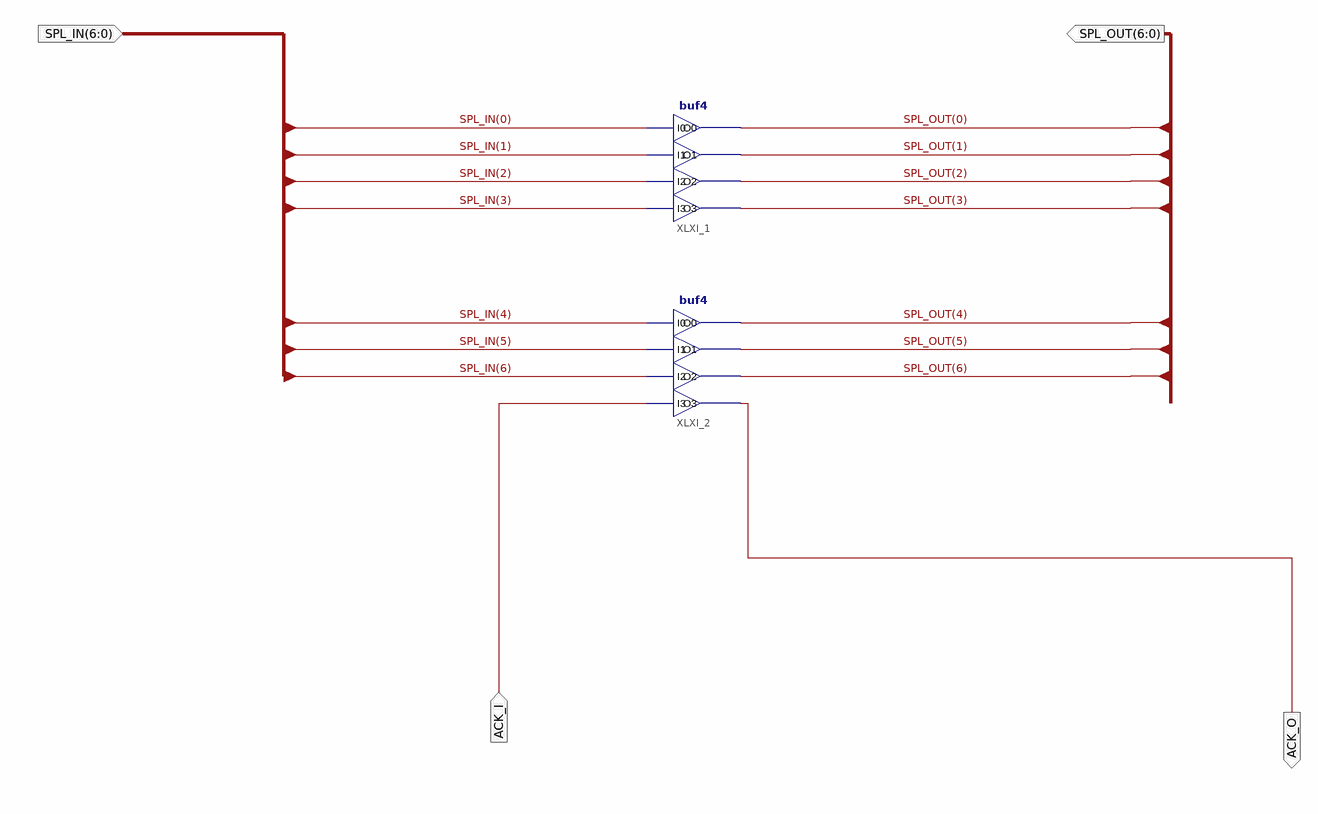
[diagram p0: schematic sheet 1]
// Xilinx ISE schematic spin_router.sch (xbr) as structural Verilog: 2 symbols, 4 ports
module spin_router (
  input  [6:0] SPL_IN,
  input  ACK_I,
  output [6:0] SPL_OUT,
  output ACK_O
);

  buf4 XLXI_1 (
    .I0(SPL_IN[0]), .I1(SPL_IN[1]), .I2(SPL_IN[2]), .I3(SPL_IN[3]), .O0(SPL_OUT[0]), .O1(SPL_OUT[1]),
    .O2(SPL_OUT[2]), .O3(SPL_OUT[3]));
  buf4 XLXI_2 (
    .I0(SPL_IN[4]), .I1(SPL_IN[5]), .I2(SPL_IN[6]), .I3(ACK_I), .O0(SPL_OUT[4]), .O1(SPL_OUT[5]),
    .O2(SPL_OUT[6]), .O3(ACK_O));
endmodule
